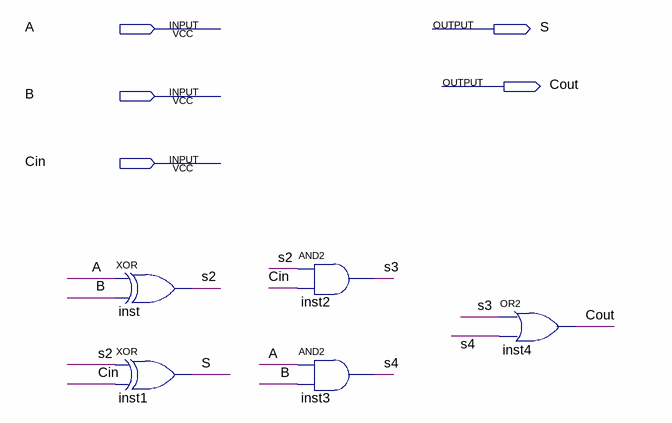
[diagram p0: schematic sheet]
// Quartus schematic FA.bdf as structural Verilog: 5 symbols, 5 pins
module FA (
  input  A,
  input  B,
  input  Cin,
  output S,
  output Cout
);

  wire s2, s3, s4;

  xor inst (s2, A, B);
  xor inst1 (S, s2, Cin);
  and inst2 (s3, s2, Cin);
  and inst3 (s4, A, B);
  or inst4 (Cout, s3, s4);
endmodule
